# Altium schematic sheet IDC_EXT_Connectors.SchDoc: =ProjectName
size 420 x 297 mm; Author: G.K.; CompanyName: WUT; DrawnBy: P.K.; Organization: WUT ISE; Address1: Warsaw Univeristy of Technology; Address2: Nowowiejska 15/19; DocumentNumber: 3; Revision: 2.0; SheetNumber: 3; SheetTotal: 12; EDA_Number: ARTIQ; Projet: ARTIQ/SINARA; ModifiedBy: -; CreateDate: XX/XX/XXXX; CheckedDate: -; Title2: IDC_EXT_Connectors.SchDoc; DivGrp: ISE; Designer: P.K.; ModifiedDate: -; ProjectName: ARTIQ/SINARA
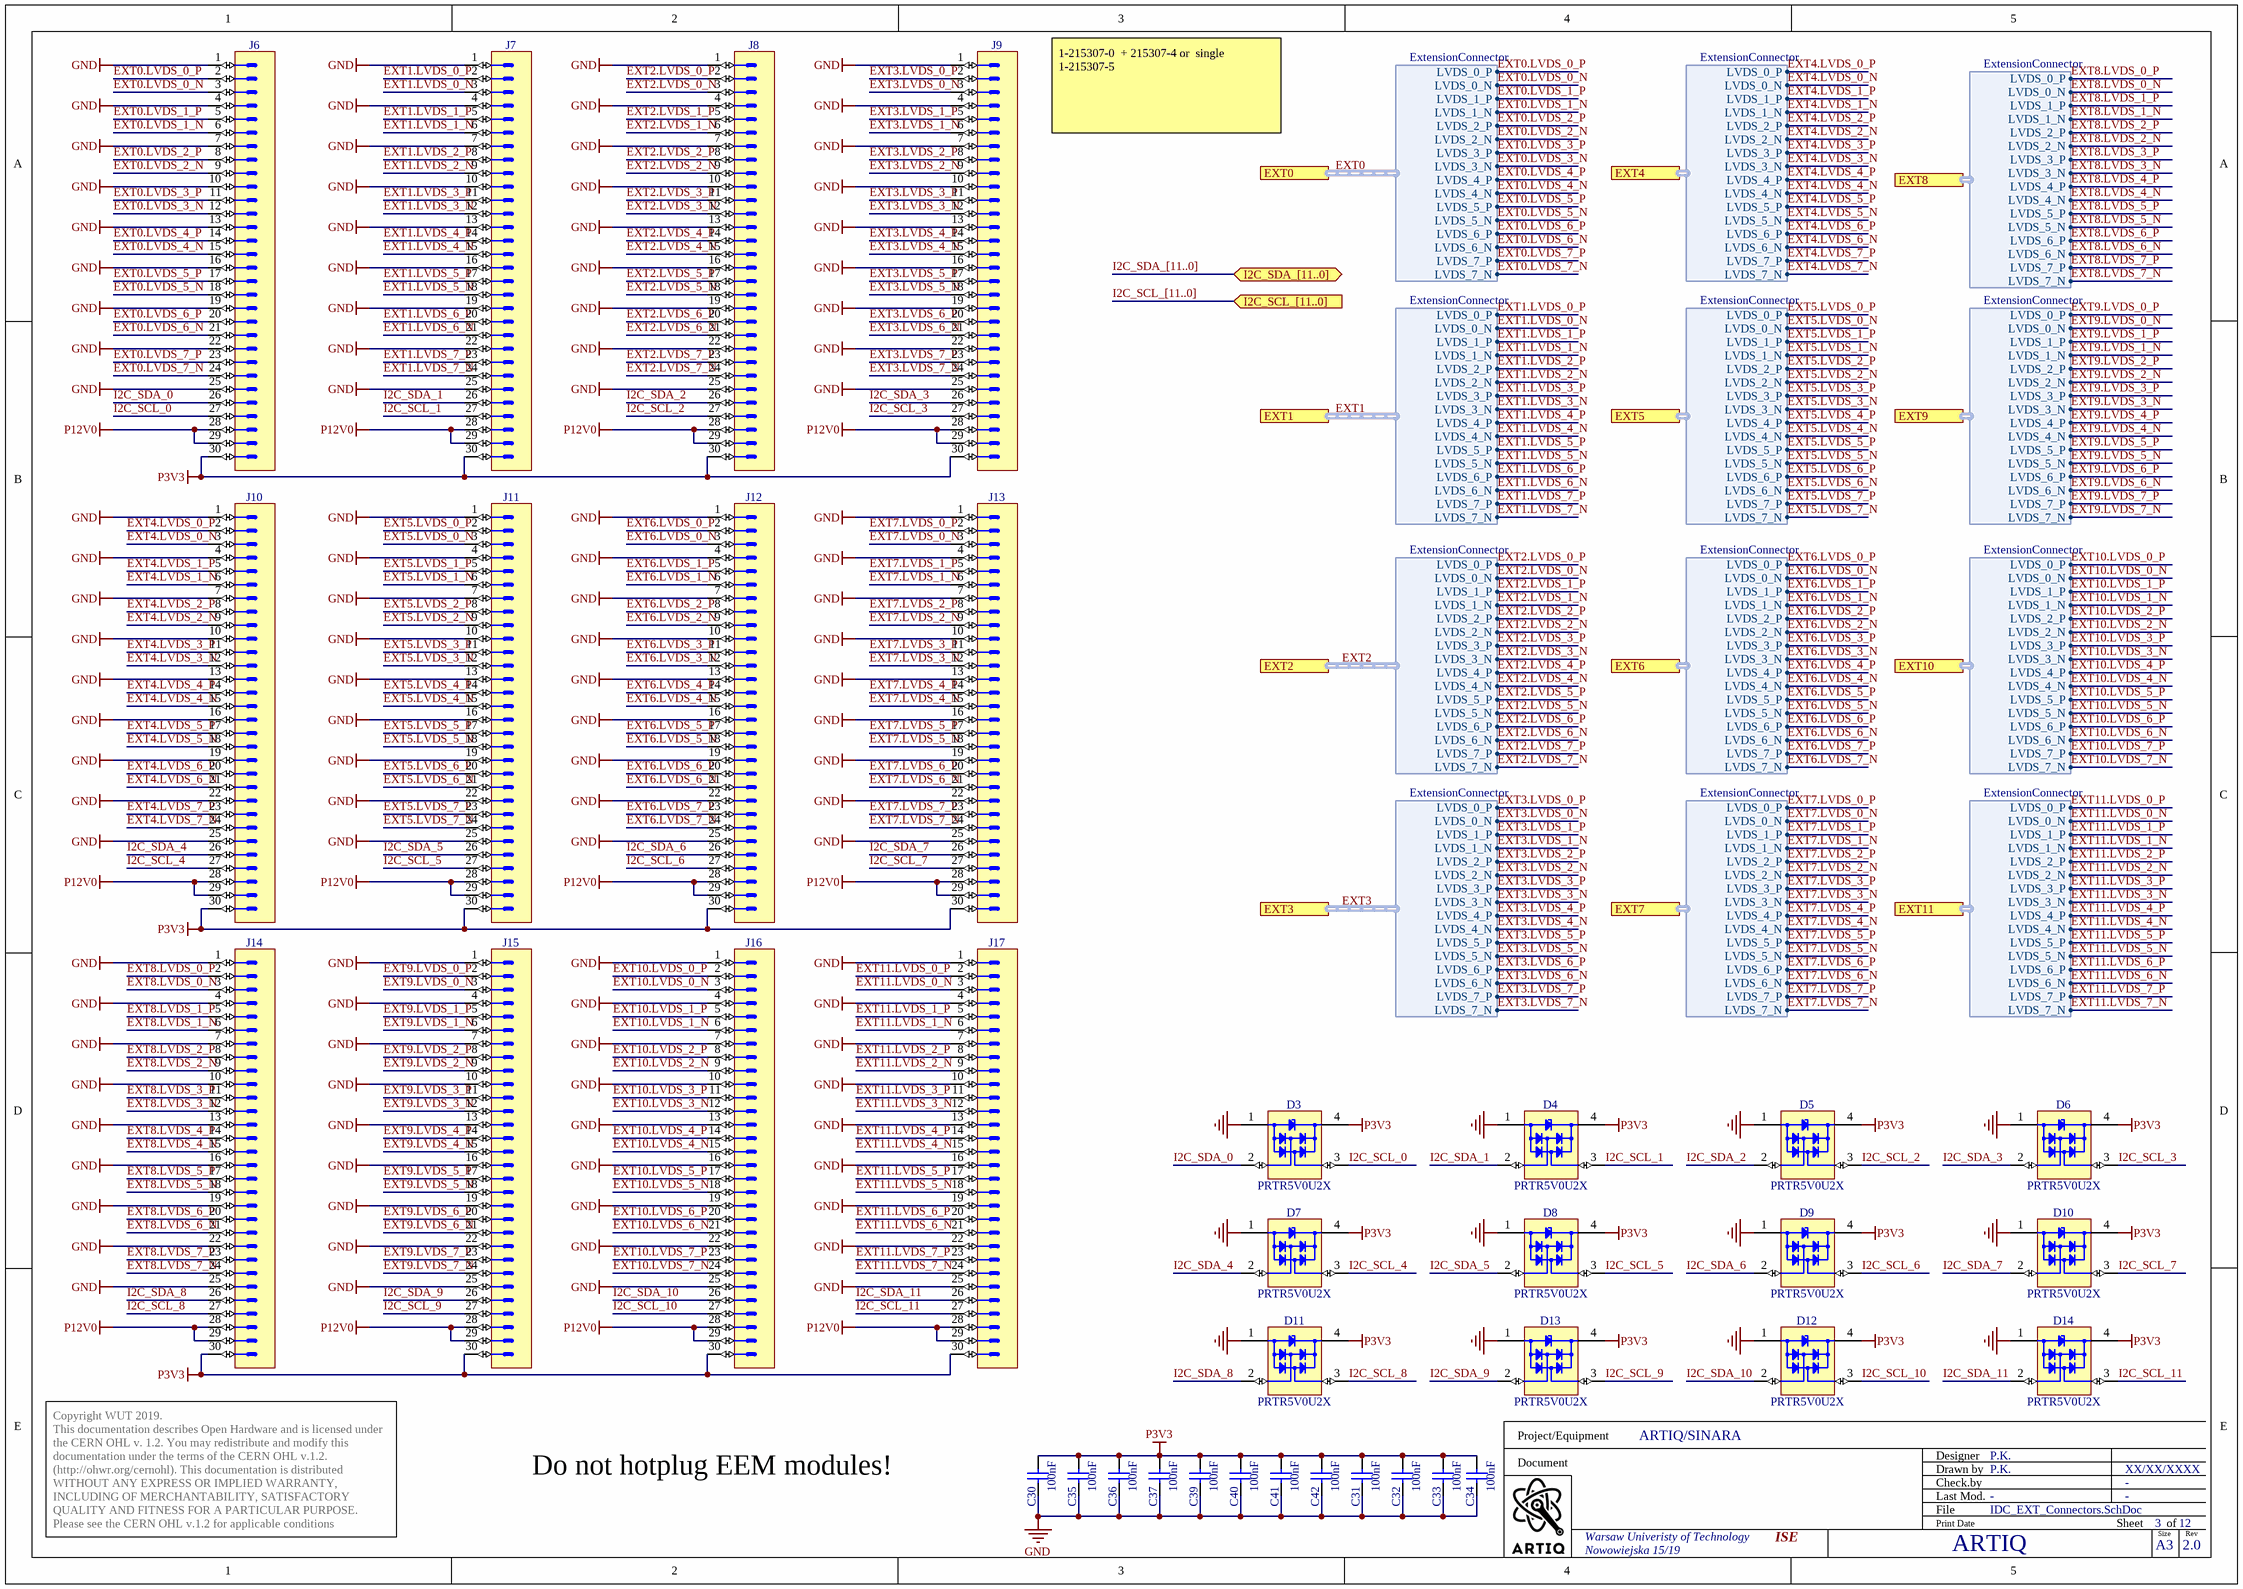
[diagram p0: IDC_EXT_Connectors.SchDoc]

## Parts
C30  100nF  [CAPC0603X33N]
C31  100nF  [CAPC0603X33N]
C32  100nF  [CAPC0603X33N]
C33  100nF  [CAPC0603X33N]
C34  100nF  [CAPC0603X33N]
C35  100nF  [CAPC0603X33N]
C36  100nF  [CAPC0603X33N]
C37  100nF  [CAPC0603X33N]
C39  100nF  [CAPC0603X33N]
C40  100nF  [CAPC0603X33N]
C41  100nF  [CAPC0603X33N]
C42  100nF  [CAPC0603X33N]
D3  PRTR5V0U2X  [SOT190P230X110-4N]
D4  PRTR5V0U2X  [SOT190P230X110-4N]
D5  PRTR5V0U2X  [SOT190P230X110-4N]
D6  PRTR5V0U2X  [SOT190P230X110-4N]
D7  PRTR5V0U2X  [SOT190P230X110-4N]
D8  PRTR5V0U2X  [SOT190P230X110-4N]
D9  PRTR5V0U2X  [SOT190P230X110-4N]
D10  PRTR5V0U2X  [SOT190P230X110-4N]
D11  PRTR5V0U2X  [SOT190P230X110-4N]
D12  PRTR5V0U2X  [SOT190P230X110-4N]
D13  PRTR5V0U2X  [SOT190P230X110-4N]
D14  PRTR5V0U2X  [SOT190P230X110-4N]
J6  AMPMODU  [TYCO_1-215307-5]  (value not drawn)
J7  AMPMODU  [TYCO_1-215307-5]  (value not drawn)
J8  AMPMODU  [TYCO_1-215307-5]  (value not drawn)
J9  AMPMODU  [TYCO_1-215307-5]  (value not drawn)
J10  AMPMODU  [TYCO_1-215307-5]  (value not drawn)
J11  AMPMODU  [TYCO_1-215307-5]  (value not drawn)
J12  AMPMODU  [TYCO_1-215307-5]  (value not drawn)
J13  AMPMODU  [TYCO_1-215307-5]  (value not drawn)
J14  AMPMODU  [TYCO_1-215307-5]  (value not drawn)
J15  AMPMODU  [TYCO_1-215307-5]  (value not drawn)
J16  AMPMODU  [TYCO_1-215307-5]  (value not drawn)
J17  AMPMODU  [TYCO_1-215307-5]  (value not drawn)

## Ports
EXT0 (harness ExtensionConnector), EXT1 (harness ExtensionConnector), EXT2 (harness ExtensionConnector), EXT3 (harness ExtensionConnector), EXT4 (harness ExtensionConnector), EXT5 (harness ExtensionConnector), EXT6 (harness ExtensionConnector), EXT7 (harness ExtensionConnector), EXT8 (harness ExtensionConnector), EXT9 (harness ExtensionConnector), EXT10 (harness ExtensionConnector), EXT11 (harness ExtensionConnector), I2C_SCL_[11..0] (in), I2C_SDA_[11..0] (bidir)

## Harnesses
ExtensionConnector: LVDS_0_N, LVDS_0_P, LVDS_1_N, LVDS_1_P, LVDS_2_N, LVDS_2_P, LVDS_3_N, LVDS_3_P, LVDS_4_N, LVDS_4_P, LVDS_5_N, LVDS_5_P, LVDS_6_N, LVDS_6_P, LVDS_7_N, LVDS_7_P

## Nets
GND: C30.1 C31.1 C32.1 C33.1 C34.1 C35.1 C36.1 C37.1 C39.1 C40.1 C41.1 C42.1 D3.1(GND) D4.1(GND) D5.1(GND) D6.1(GND) D7.1(GND) D8.1(GND) D9.1(GND) D10.1(GND) D11.1(GND) D12.1(GND) D13.1(GND) D14.1(GND) J6.1 J6.4 J6.7 J6.10 J6.13 J6.16 J6.19 J6.22 J6.25 J7.1 J7.4 J7.7 J7.10 J7.13 J7.16 J7.19 J7.22 J7.25 J8.1 J8.4 J8.7 J8.10 J8.13 J8.16 J8.19 J8.22 J8.25 J9.1 J9.4 J9.7 J9.10 J9.13 J9.16 J9.19 J9.22 J9.25 J10.1 J10.4 J10.7 J10.10 J10.13 J10.16 J10.19 J10.22 J10.25 J11.1 J11.4 J11.7 J11.10 J11.13 J11.16 J11.19 J11.22 J11.25 J12.1 J12.4 J12.7 J12.10 J12.13 J12.16 J12.19 J12.22 J12.25 J13.1 J13.4 J13.7 J13.10 J13.13 J13.16 J13.19 J13.22 J13.25 J14.1 J14.4 J14.7 J14.10 J14.13 J14.16 J14.19 J14.22 J14.25 J15.1 J15.4 J15.7 J15.10 J15.13 J15.16 J15.19 J15.22 J15.25 J16.1 J16.4 J16.7 J16.10 J16.13 J16.16 J16.19 J16.22 J16.25 J17.1 J17.4 J17.7 J17.10 J17.13 J17.16 J17.19 J17.22 J17.25
P3V3: C30.2 C31.2 C32.2 C33.2 C34.2 C35.2 C36.2 C37.2 C39.2 C40.2 C41.2 C42.2 D3.4(VCC) D4.4(VCC) D5.4(VCC) D6.4(VCC) D7.4(VCC) D8.4(VCC) D9.4(VCC) D10.4(VCC) D11.4(VCC) D12.4(VCC) D13.4(VCC) D14.4(VCC) J6.30 J7.30 J8.30 J9.30 J10.30 J11.30 J12.30 J13.30 J14.30 J15.30 J16.30 J17.30
P12V0: J6.28 J6.29 J7.28 J7.29 J8.28 J8.29 J9.28 J9.29 J10.28 J10.29 J11.28 J11.29 J12.28 J12.29 J13.28 J13.29 J14.28 J14.29 J15.28 J15.29 J16.28 J16.29 J17.28 J17.29
EXT0.LVDS_0_N: J6.3 ; port EXT0.LVDS_0_N
EXT0.LVDS_0_P: J6.2 ; port EXT0.LVDS_0_P
EXT0.LVDS_1_N: J6.6 ; port EXT0.LVDS_1_N
EXT0.LVDS_1_P: J6.5 ; port EXT0.LVDS_1_P
EXT0.LVDS_2_N: J6.9 ; port EXT0.LVDS_2_N
EXT0.LVDS_2_P: J6.8 ; port EXT0.LVDS_2_P
EXT0.LVDS_3_N: J6.12 ; port EXT0.LVDS_3_N
EXT0.LVDS_3_P: J6.11 ; port EXT0.LVDS_3_P
EXT0.LVDS_4_N: J6.15 ; port EXT0.LVDS_4_N
EXT0.LVDS_4_P: J6.14 ; port EXT0.LVDS_4_P
EXT0.LVDS_5_N: J6.18 ; port EXT0.LVDS_5_N
EXT0.LVDS_5_P: J6.17 ; port EXT0.LVDS_5_P
EXT0.LVDS_6_N: J6.21 ; port EXT0.LVDS_6_N
EXT0.LVDS_6_P: J6.20 ; port EXT0.LVDS_6_P
EXT0.LVDS_7_N: J6.24 ; port EXT0.LVDS_7_N
EXT0.LVDS_7_P: J6.23 ; port EXT0.LVDS_7_P
EXT1.LVDS_0_N: J7.3 ; port EXT1.LVDS_0_N
EXT1.LVDS_0_P: J7.2 ; port EXT1.LVDS_0_P
EXT1.LVDS_1_N: J7.6 ; port EXT1.LVDS_1_N
EXT1.LVDS_1_P: J7.5 ; port EXT1.LVDS_1_P
EXT1.LVDS_2_N: J7.9 ; port EXT1.LVDS_2_N
EXT1.LVDS_2_P: J7.8 ; port EXT1.LVDS_2_P
EXT1.LVDS_3_N: J7.12 ; port EXT1.LVDS_3_N
EXT1.LVDS_3_P: J7.11 ; port EXT1.LVDS_3_P
EXT1.LVDS_4_N: J7.15 ; port EXT1.LVDS_4_N
EXT1.LVDS_4_P: J7.14 ; port EXT1.LVDS_4_P
EXT1.LVDS_5_N: J7.18 ; port EXT1.LVDS_5_N
EXT1.LVDS_5_P: J7.17 ; port EXT1.LVDS_5_P
EXT1.LVDS_6_N: J7.21 ; port EXT1.LVDS_6_N
EXT1.LVDS_6_P: J7.20 ; port EXT1.LVDS_6_P
EXT1.LVDS_7_N: J7.24 ; port EXT1.LVDS_7_N
EXT1.LVDS_7_P: J7.23 ; port EXT1.LVDS_7_P
EXT2.LVDS_0_N: J8.3 ; port EXT2.LVDS_0_N
EXT2.LVDS_0_P: J8.2 ; port EXT2.LVDS_0_P
EXT2.LVDS_1_N: J8.6 ; port EXT2.LVDS_1_N
EXT2.LVDS_1_P: J8.5 ; port EXT2.LVDS_1_P
EXT2.LVDS_2_N: J8.9 ; port EXT2.LVDS_2_N
EXT2.LVDS_2_P: J8.8 ; port EXT2.LVDS_2_P
EXT2.LVDS_3_N: J8.12 ; port EXT2.LVDS_3_N
EXT2.LVDS_3_P: J8.11 ; port EXT2.LVDS_3_P
EXT2.LVDS_4_N: J8.15 ; port EXT2.LVDS_4_N
EXT2.LVDS_4_P: J8.14 ; port EXT2.LVDS_4_P
EXT2.LVDS_5_N: J8.18 ; port EXT2.LVDS_5_N
EXT2.LVDS_5_P: J8.17 ; port EXT2.LVDS_5_P
EXT2.LVDS_6_N: J8.21 ; port EXT2.LVDS_6_N
EXT2.LVDS_6_P: J8.20 ; port EXT2.LVDS_6_P
EXT2.LVDS_7_N: J8.24 ; port EXT2.LVDS_7_N
EXT2.LVDS_7_P: J8.23 ; port EXT2.LVDS_7_P
EXT3.LVDS_0_N: J9.3 ; port EXT3.LVDS_0_N
EXT3.LVDS_0_P: J9.2 ; port EXT3.LVDS_0_P
EXT3.LVDS_1_N: J9.6 ; port EXT3.LVDS_1_N
EXT3.LVDS_1_P: J9.5 ; port EXT3.LVDS_1_P
EXT3.LVDS_2_N: J9.9 ; port EXT3.LVDS_2_N
EXT3.LVDS_2_P: J9.8 ; port EXT3.LVDS_2_P
EXT3.LVDS_3_N: J9.12 ; port EXT3.LVDS_3_N
EXT3.LVDS_3_P: J9.11 ; port EXT3.LVDS_3_P
EXT3.LVDS_4_N: J9.15 ; port EXT3.LVDS_4_N
EXT3.LVDS_4_P: J9.14 ; port EXT3.LVDS_4_P
EXT3.LVDS_5_N: J9.18 ; port EXT3.LVDS_5_N
EXT3.LVDS_5_P: J9.17 ; port EXT3.LVDS_5_P
EXT3.LVDS_6_N: J9.21 ; port EXT3.LVDS_6_N
EXT3.LVDS_6_P: J9.20 ; port EXT3.LVDS_6_P
EXT3.LVDS_7_N: J9.24 ; port EXT3.LVDS_7_N
EXT3.LVDS_7_P: J9.23 ; port EXT3.LVDS_7_P
EXT4.LVDS_0_N: J10.3 ; port EXT4.LVDS_0_N
EXT4.LVDS_0_P: J10.2 ; port EXT4.LVDS_0_P
EXT4.LVDS_1_N: J10.6 ; port EXT4.LVDS_1_N
EXT4.LVDS_1_P: J10.5 ; port EXT4.LVDS_1_P
EXT4.LVDS_2_N: J10.9 ; port EXT4.LVDS_2_N
EXT4.LVDS_2_P: J10.8 ; port EXT4.LVDS_2_P
EXT4.LVDS_3_N: J10.12 ; port EXT4.LVDS_3_N
EXT4.LVDS_3_P: J10.11 ; port EXT4.LVDS_3_P
EXT4.LVDS_4_N: J10.15 ; port EXT4.LVDS_4_N
EXT4.LVDS_4_P: J10.14 ; port EXT4.LVDS_4_P
EXT4.LVDS_5_N: J10.18 ; port EXT4.LVDS_5_N
EXT4.LVDS_5_P: J10.17 ; port EXT4.LVDS_5_P
EXT4.LVDS_6_N: J10.21 ; port EXT4.LVDS_6_N
EXT4.LVDS_6_P: J10.20 ; port EXT4.LVDS_6_P
EXT4.LVDS_7_N: J10.24 ; port EXT4.LVDS_7_N
EXT4.LVDS_7_P: J10.23 ; port EXT4.LVDS_7_P
EXT5.LVDS_0_N: J11.3 ; port EXT5.LVDS_0_N
EXT5.LVDS_0_P: J11.2 ; port EXT5.LVDS_0_P
EXT5.LVDS_1_N: J11.6 ; port EXT5.LVDS_1_N
EXT5.LVDS_1_P: J11.5 ; port EXT5.LVDS_1_P
EXT5.LVDS_2_N: J11.9 ; port EXT5.LVDS_2_N
EXT5.LVDS_2_P: J11.8 ; port EXT5.LVDS_2_P
EXT5.LVDS_3_N: J11.12 ; port EXT5.LVDS_3_N
EXT5.LVDS_3_P: J11.11 ; port EXT5.LVDS_3_P
EXT5.LVDS_4_N: J11.15 ; port EXT5.LVDS_4_N
EXT5.LVDS_4_P: J11.14 ; port EXT5.LVDS_4_P
EXT5.LVDS_5_N: J11.18 ; port EXT5.LVDS_5_N
EXT5.LVDS_5_P: J11.17 ; port EXT5.LVDS_5_P
EXT5.LVDS_6_N: J11.21 ; port EXT5.LVDS_6_N
EXT5.LVDS_6_P: J11.20 ; port EXT5.LVDS_6_P
EXT5.LVDS_7_N: J11.24 ; port EXT5.LVDS_7_N
EXT5.LVDS_7_P: J11.23 ; port EXT5.LVDS_7_P
EXT6.LVDS_0_N: J12.3 ; port EXT6.LVDS_0_N
EXT6.LVDS_0_P: J12.2 ; port EXT6.LVDS_0_P
EXT6.LVDS_1_N: J12.6 ; port EXT6.LVDS_1_N
EXT6.LVDS_1_P: J12.5 ; port EXT6.LVDS_1_P
EXT6.LVDS_2_N: J12.9 ; port EXT6.LVDS_2_N
EXT6.LVDS_2_P: J12.8 ; port EXT6.LVDS_2_P
EXT6.LVDS_3_N: J12.12 ; port EXT6.LVDS_3_N
EXT6.LVDS_3_P: J12.11 ; port EXT6.LVDS_3_P
EXT6.LVDS_4_N: J12.15 ; port EXT6.LVDS_4_N
EXT6.LVDS_4_P: J12.14 ; port EXT6.LVDS_4_P
EXT6.LVDS_5_N: J12.18 ; port EXT6.LVDS_5_N
EXT6.LVDS_5_P: J12.17 ; port EXT6.LVDS_5_P
EXT6.LVDS_6_N: J12.21 ; port EXT6.LVDS_6_N
EXT6.LVDS_6_P: J12.20 ; port EXT6.LVDS_6_P
EXT6.LVDS_7_N: J12.24 ; port EXT6.LVDS_7_N
EXT6.LVDS_7_P: J12.23 ; port EXT6.LVDS_7_P
EXT7.LVDS_0_N: J13.3 ; port EXT7.LVDS_0_N
EXT7.LVDS_0_P: J13.2 ; port EXT7.LVDS_0_P
EXT7.LVDS_1_N: J13.6 ; port EXT7.LVDS_1_N
EXT7.LVDS_1_P: J13.5 ; port EXT7.LVDS_1_P
EXT7.LVDS_2_N: J13.9 ; port EXT7.LVDS_2_N
EXT7.LVDS_2_P: J13.8 ; port EXT7.LVDS_2_P
EXT7.LVDS_3_N: J13.12 ; port EXT7.LVDS_3_N
EXT7.LVDS_3_P: J13.11 ; port EXT7.LVDS_3_P
EXT7.LVDS_4_N: J13.15 ; port EXT7.LVDS_4_N
EXT7.LVDS_4_P: J13.14 ; port EXT7.LVDS_4_P
EXT7.LVDS_5_N: J13.18 ; port EXT7.LVDS_5_N
EXT7.LVDS_5_P: J13.17 ; port EXT7.LVDS_5_P
EXT7.LVDS_6_N: J13.21 ; port EXT7.LVDS_6_N
EXT7.LVDS_6_P: J13.20 ; port EXT7.LVDS_6_P
EXT7.LVDS_7_N: J13.24 ; port EXT7.LVDS_7_N
EXT7.LVDS_7_P: J13.23 ; port EXT7.LVDS_7_P
EXT8.LVDS_0_N: J14.3 ; port EXT8.LVDS_0_N
EXT8.LVDS_0_P: J14.2 ; port EXT8.LVDS_0_P
EXT8.LVDS_1_N: J14.6 ; port EXT8.LVDS_1_N
EXT8.LVDS_1_P: J14.5 ; port EXT8.LVDS_1_P
EXT8.LVDS_2_N: J14.9 ; port EXT8.LVDS_2_N
EXT8.LVDS_2_P: J14.8 ; port EXT8.LVDS_2_P
EXT8.LVDS_3_N: J14.12 ; port EXT8.LVDS_3_N
EXT8.LVDS_3_P: J14.11 ; port EXT8.LVDS_3_P
EXT8.LVDS_4_N: J14.15 ; port EXT8.LVDS_4_N
EXT8.LVDS_4_P: J14.14 ; port EXT8.LVDS_4_P
EXT8.LVDS_5_N: J14.18 ; port EXT8.LVDS_5_N
EXT8.LVDS_5_P: J14.17 ; port EXT8.LVDS_5_P
EXT8.LVDS_6_N: J14.21 ; port EXT8.LVDS_6_N
EXT8.LVDS_6_P: J14.20 ; port EXT8.LVDS_6_P
EXT8.LVDS_7_N: J14.24 ; port EXT8.LVDS_7_N
EXT8.LVDS_7_P: J14.23 ; port EXT8.LVDS_7_P
EXT9.LVDS_0_N: J15.3 ; port EXT9.LVDS_0_N
EXT9.LVDS_0_P: J15.2 ; port EXT9.LVDS_0_P
EXT9.LVDS_1_N: J15.6 ; port EXT9.LVDS_1_N
EXT9.LVDS_1_P: J15.5 ; port EXT9.LVDS_1_P
EXT9.LVDS_2_N: J15.9 ; port EXT9.LVDS_2_N
EXT9.LVDS_2_P: J15.8 ; port EXT9.LVDS_2_P
EXT9.LVDS_3_N: J15.12 ; port EXT9.LVDS_3_N
EXT9.LVDS_3_P: J15.11 ; port EXT9.LVDS_3_P
EXT9.LVDS_4_N: J15.15 ; port EXT9.LVDS_4_N
EXT9.LVDS_4_P: J15.14 ; port EXT9.LVDS_4_P
EXT9.LVDS_5_N: J15.18 ; port EXT9.LVDS_5_N
EXT9.LVDS_5_P: J15.17 ; port EXT9.LVDS_5_P
EXT9.LVDS_6_N: J15.21 ; port EXT9.LVDS_6_N
EXT9.LVDS_6_P: J15.20 ; port EXT9.LVDS_6_P
EXT9.LVDS_7_N: J15.24 ; port EXT9.LVDS_7_N
EXT9.LVDS_7_P: J15.23 ; port EXT9.LVDS_7_P
EXT10.LVDS_0_N: J16.3 ; port EXT10.LVDS_0_N
EXT10.LVDS_0_P: J16.2 ; port EXT10.LVDS_0_P
EXT10.LVDS_1_N: J16.6 ; port EXT10.LVDS_1_N
EXT10.LVDS_1_P: J16.5 ; port EXT10.LVDS_1_P
EXT10.LVDS_2_N: J16.9 ; port EXT10.LVDS_2_N
EXT10.LVDS_2_P: J16.8 ; port EXT10.LVDS_2_P
EXT10.LVDS_3_N: J16.12 ; port EXT10.LVDS_3_N
EXT10.LVDS_3_P: J16.11 ; port EXT10.LVDS_3_P
EXT10.LVDS_4_N: J16.15 ; port EXT10.LVDS_4_N
EXT10.LVDS_4_P: J16.14 ; port EXT10.LVDS_4_P
EXT10.LVDS_5_N: J16.18 ; port EXT10.LVDS_5_N
EXT10.LVDS_5_P: J16.17 ; port EXT10.LVDS_5_P
EXT10.LVDS_6_N: J16.21 ; port EXT10.LVDS_6_N
EXT10.LVDS_6_P: J16.20 ; port EXT10.LVDS_6_P
EXT10.LVDS_7_N: J16.24 ; port EXT10.LVDS_7_N
EXT10.LVDS_7_P: J16.23 ; port EXT10.LVDS_7_P
EXT11.LVDS_0_N: J17.3 ; port EXT11.LVDS_0_N
EXT11.LVDS_0_P: J17.2 ; port EXT11.LVDS_0_P
EXT11.LVDS_1_N: J17.6 ; port EXT11.LVDS_1_N
EXT11.LVDS_1_P: J17.5 ; port EXT11.LVDS_1_P
EXT11.LVDS_2_N: J17.9 ; port EXT11.LVDS_2_N
EXT11.LVDS_2_P: J17.8 ; port EXT11.LVDS_2_P
EXT11.LVDS_3_N: J17.12 ; port EXT11.LVDS_3_N
EXT11.LVDS_3_P: J17.11 ; port EXT11.LVDS_3_P
EXT11.LVDS_4_N: J17.15 ; port EXT11.LVDS_4_N
EXT11.LVDS_4_P: J17.14 ; port EXT11.LVDS_4_P
EXT11.LVDS_5_N: J17.18 ; port EXT11.LVDS_5_N
EXT11.LVDS_5_P: J17.17 ; port EXT11.LVDS_5_P
EXT11.LVDS_6_N: J17.21 ; port EXT11.LVDS_6_N
EXT11.LVDS_6_P: J17.20 ; port EXT11.LVDS_6_P
EXT11.LVDS_7_N: J17.24 ; port EXT11.LVDS_7_N
EXT11.LVDS_7_P: J17.23 ; port EXT11.LVDS_7_P
I2C_SCL_0: D3.3(I/O2) J6.27
I2C_SCL_1: D4.3(I/O2) J7.27
I2C_SCL_2: D5.3(I/O2) J8.27
I2C_SCL_3: D6.3(I/O2) J9.27
I2C_SCL_4: D7.3(I/O2) J10.27
I2C_SCL_5: D8.3(I/O2) J11.27
I2C_SCL_6: D9.3(I/O2) J12.27
I2C_SCL_7: D10.3(I/O2) J13.27
I2C_SCL_8: D11.3(I/O2) J14.27
I2C_SCL_9: D13.3(I/O2) J15.27
I2C_SCL_10: D12.3(I/O2) J16.27
I2C_SCL_11: D14.3(I/O2) J17.27
I2C_SDA_0: D3.2(I/O1) J6.26
I2C_SDA_1: D4.2(I/O1) J7.26
I2C_SDA_2: D5.2(I/O1) J8.26
I2C_SDA_3: D6.2(I/O1) J9.26
I2C_SDA_4: D7.2(I/O1) J10.26
I2C_SDA_5: D8.2(I/O1) J11.26
I2C_SDA_6: D9.2(I/O1) J12.26
I2C_SDA_7: D10.2(I/O1) J13.26
I2C_SDA_8: D11.2(I/O1) J14.26
I2C_SDA_9: D13.2(I/O1) J15.26
I2C_SDA_10: D12.2(I/O1) J16.26
I2C_SDA_11: D14.2(I/O1) J17.26

## Buses and harness runs
bus I2C_SCL_[11..0] = port I2C_SCL_[11..0]
bus I2C_SDA_[11..0] = port I2C_SDA_[11..0]
harness EXT0 = port EXT0
harness EXT1 = port EXT1
harness EXT2 = port EXT2
harness EXT3 = port EXT3

## Notes on the sheet
- 1-215307-0  + 215307-4 or  single 1-215307-5
- Do not hotplug EEM modules!
- Project/Equipment
- Document
- Designer
- Drawn by
- Check.by
- Copyright WUT 2019.
  This documentation describes Open Hardware and is licensed under the CERN OHL v. 1.2. You may redistribute and modify this documentation under the terms of the CERN OHL v.1.2. (http://ohwr.org/cernohl). This documentation is distributed WITHOUT ANY EXPRESS OR IMPLIED WARRANTY, INCLUDING OF MERCHANTABILITY, SATISFACTORY QUALITY AND FITNESS FOR A PARTICULAR PURPOSE. Please see the CERN OHL v.1.2 for applicable conditions
- File
- Last Mod.
- Print Date
- Sheet
- Size
- A3
- of
- Rev

## Library data of the parts
C30-C37 C39-C42 = CC0201_100NF_6.3V_10%_X5R: Non-polarised capacitor; Part Description: SMD Multilayer Chip Ceramic Capacitor; Manufacturer: GENERIC; Manufacturer1 Part Number: 02016D104KAT2A; Voltage: 6.3V; TC: X5R; Tolerance: ±10%; Part Number: CC0201_100NF_6.3V_10%_X5R; Component Kind: Standard; Component Type: Standard; Pin Count: 2; Value: 100nF; Status: Not Recommended; Manufacturer Part Number: CC0201_100NF_6.3V_10%_X5R; Case: 0201; Mounted: Yes; Socket: No; SMD: Yes; Sense: No; Manufacturer1 Example: AVX; Manufacturer1 ComponentHeight: 0.33mm; HelpURL: \\cern.ch\dfs\Applications\Altium\Datasheets\CC0201_X5R_AVX.pdf; Author: CERN DEM JLC; CreateDate: 2007-12-03; LatestRevisionDate: 2007-12-03
D3-D14 = PRTR5V0U2X: Ultra Low Capacitance Double Rail-to-Rail ESD Protection Diode; Part Description: Ultra Low Capacitance (1pF) Double Rail-to-Rail ESD Protection Diode (8kV); Manufacturer: NXP SEMICONDUCTORS; Voltage: 5.5V; PressFit: No; Bonding: No; Part Number: PRTR5V0U2X; Component Kind: Standard; Component Type: Standard; Device: PRTR5V0U2X; PackageDescription: SOT143B, SOT, 1.90mm Pitch; 4 Pin, 1.30mm W X 2.90mm L X 1.10mm H body, IPC Medium Density; Manufacturer Part Number: PRTR5V0U2X; Pin Count: 4; Case: SOT143B; Mounted: Yes; Socket: No; SMD: Yes; Sense: No; ComponentHeight: 1.1mm; HelpURL: \\cern.ch\dfs\Applications\Altium\Datasheets\PRTR5V0U2X.pdf; Author: CERN DEM JLC; CreateDate: 22.03.2011; LatestRevisionDate: 22.03.2011
J6-J17 = CON_2x15_2.54_female_V_mirror: Connector 2.54mm, 30 pin female, vertical, 7mm, AMPMODU HV-100/HV-190; Part Description: 34 Contacts, Dual Row Vertical Low Profile IDC Shrouded Header, with Long Eject Latch; Manufacturer: TYCO ELECTRONICS; Manufacturer Part Number: 1-215307-5; PressFit: No; Part Number: TYCO_1-215307-5; Component Kind: Standard; Component Type: Standard; Pin Count: 30; Family: AMPMODU; Mounted: Yes; Socket: No; SMD: No; Sense: No; Status: None; ComponentHeight: 22.86mm; HelpURL: \\cern.ch\dfs\Applications\Altium\Datasheets\TYCO_3-1761606-1.pdf; Author: GK; CreateDate: 05.10.2015; LatestRevisionDate: 05.10.2015